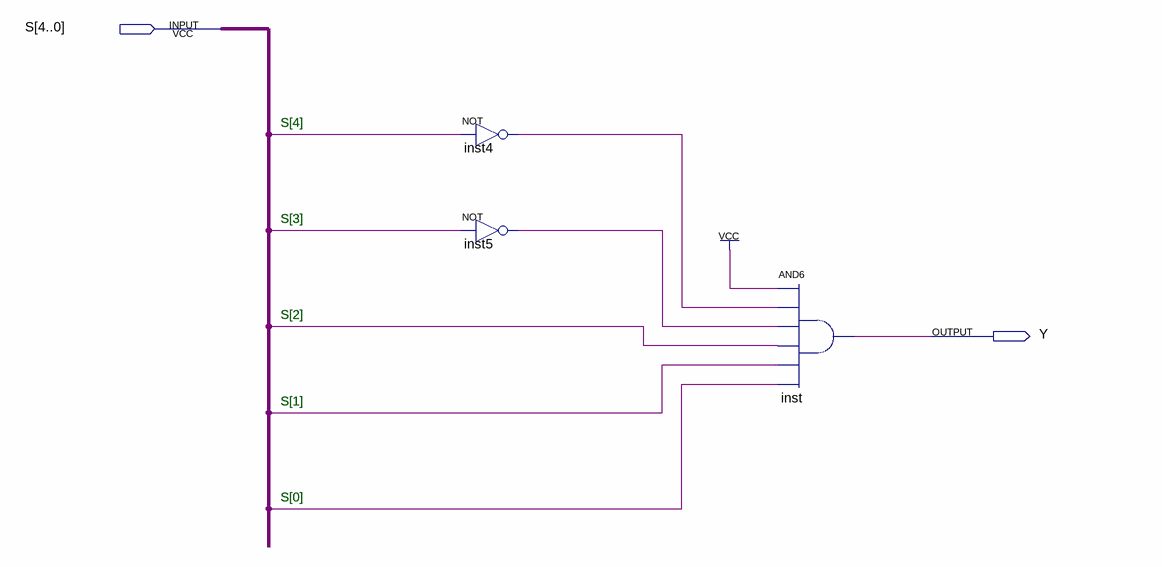
[diagram p0: schematic sheet]
// Quartus schematic S7.bdf as structural Verilog: 3 symbols, 2 pins
module S7 (
  input  [4:0] S,
  output Y
);

  wire inst4_out, inst5_out;

  not inst4 (inst4_out, S[4]);
  not inst5 (inst5_out, S[3]);
  and inst (Y, 1'b1, inst4_out, inst5_out, S[2], S[1], S[0]);

  // Notes on the sheet:
  //   S[4]
  //   S[3]
  //   S[2]
  //   S[1]
  //   S[0]
endmodule
